# EAGLE design LB_BIT_o21_number-v03(rev3_3) (EAGLE 6.6.0)
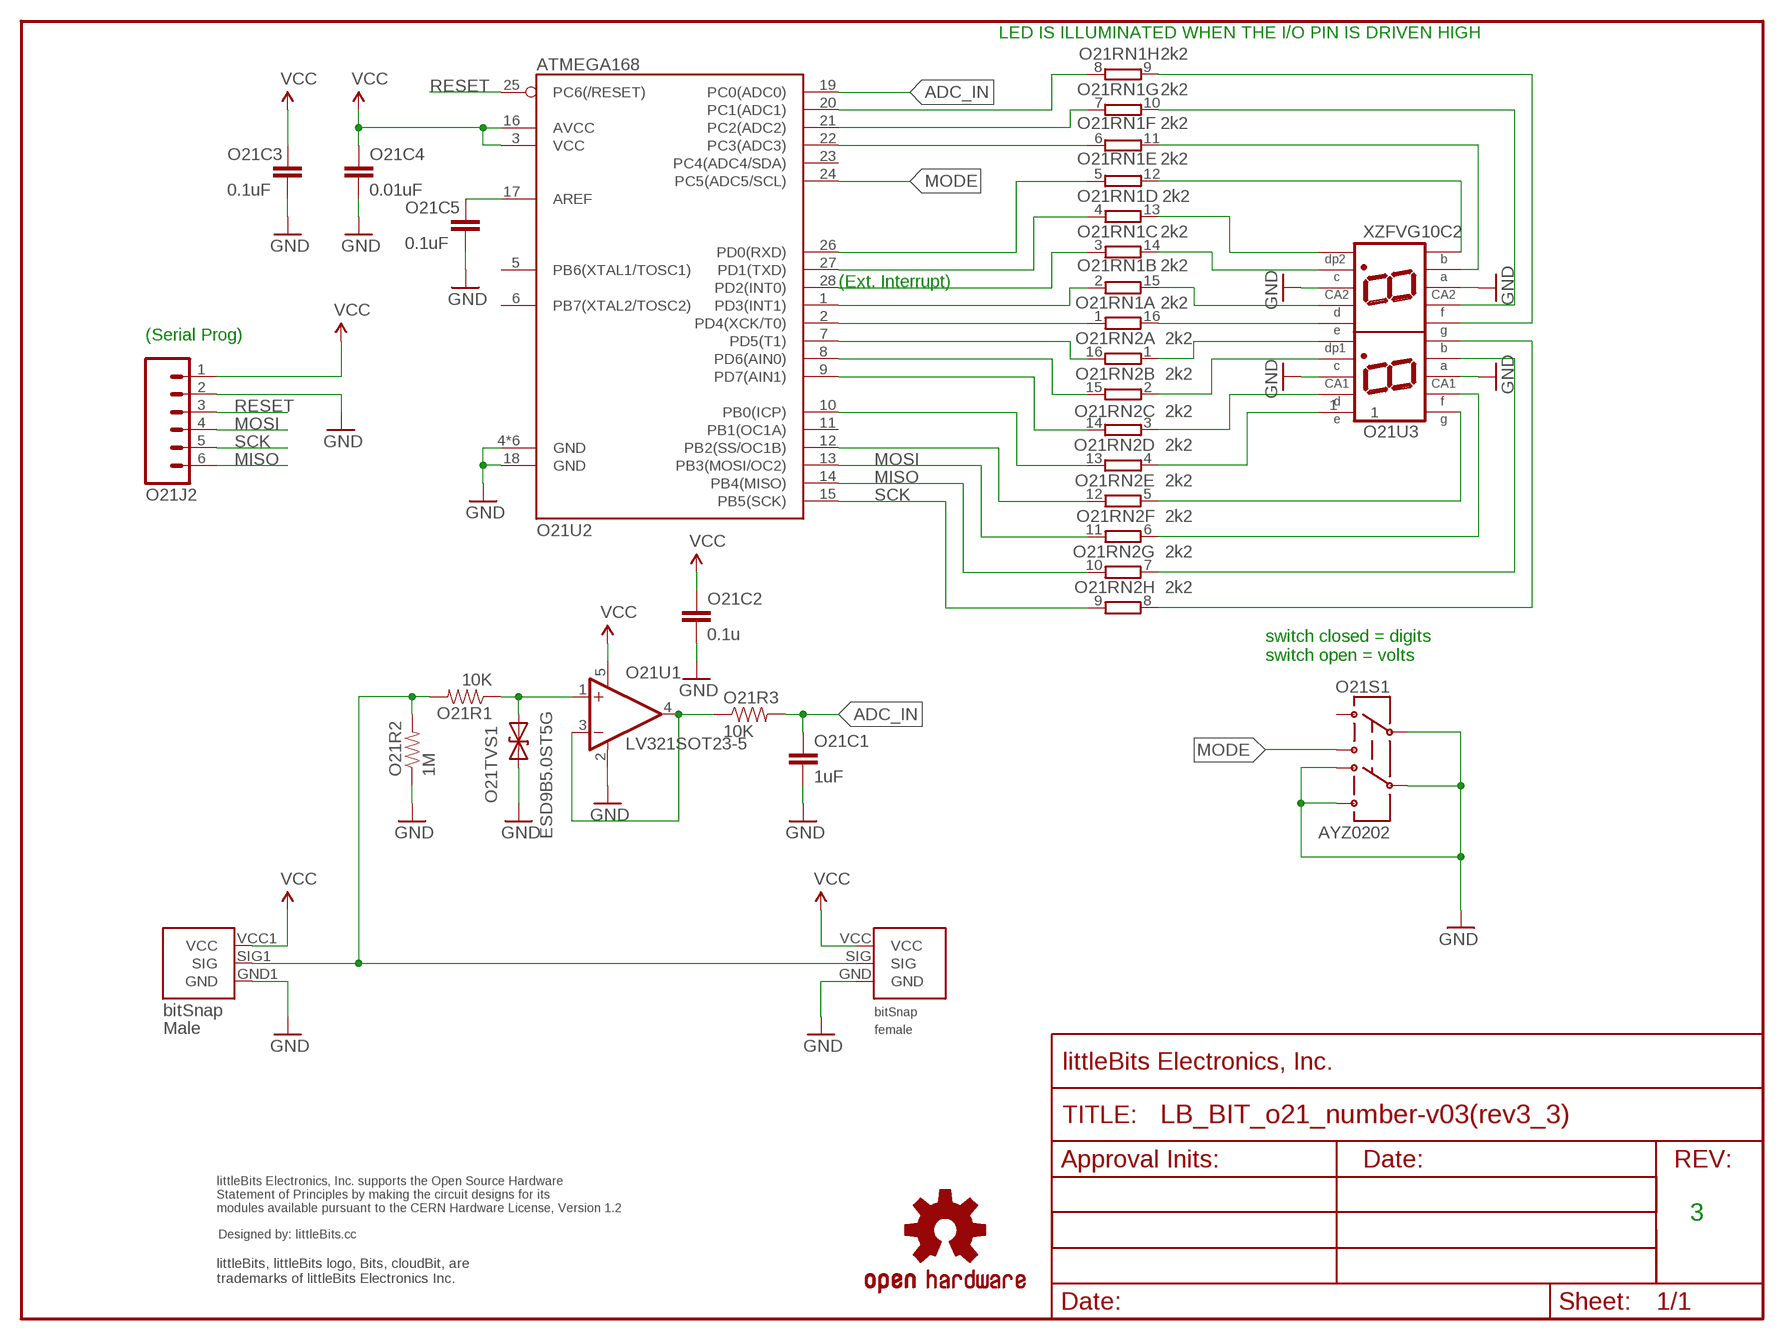
[diagram p0: schematic, sheet 1]

## Parts
O21BSF1  BITSNAP_V03_FEMALE  [BITSNAP_V03_FEMALE]
O21BSM1  BITSNAP_V03_MALE  [BITSNAP_V03_MALE]
O21C1  1uF  CAPCAP-0603  [CAP-0603]
O21C2  0.1u  CAPCAP-0603  [CAP-0603]
O21C3  0.1uF  CAPCAP-0603  [CAP-0603]
O21C4  0.01uF  CAPCAP-0603  [CAP-0603]
O21C5  0.1uF  CAPCAP-0603  [CAP-0603]
O21J2  HRD-60.1INCH_NO_SILKSCREEN  [SIP6-SM-0.1IN-NOS.S.]
O21R1  10K  RESISTOR0603  [RES-0603]
O21R2  1M  RESISTOR0603  [RES-0603]
O21R3  10K  RESISTOR0603  [RES-0603]
O21RN1  2k2  RES_ARRAY8_DIPEXB2HV  [EXB2HV]
O21RN2  2k2  RES_ARRAY8_DIPEXB2HV  [EXB2HV]
O21S1  AYZ0202  [AYZ0202]
O21TVS1  ESD9B5.0ST5G  DIODE-TVSSOD-923  [SOD-923]
O21U1  LV321SOT23-5  [SOT23-5]
O21U2  ATMEGA168  ATMEGA168-28PINVFQFN-28  [VQFN28]
O21U3  XZFVG10C2  LED-DUAL7SEG10.16MMDIGITS  [LED-DUAL7SEG-SM]
U$7  OSHWCREDIT  [OSHWCREDIT]
U$16  FRAME-LETTER-OHWOHW  [FABDWG01-OHW]
U$27  OSHW-LOGOL  [OSHW-LOGO-L]

## Nets
ADC_IN: O21C1.1 O21R3.2 O21U2.19(PC0(ADC0))
BIT_SIG: O21R3.1 O21U1.3(-IN) O21U1.4(OUT)
GND: O21BSF1.GND O21BSM1.GND1(GND) O21C1.2 O21C2.2 O21C3.2 O21C4.2 O21C5.2 O21J2.2 O21R2.1 O21S1.2 O21S1.4 O21S1.5 O21S1.6 O21TVS1.1(A) O21U1.2(V-) O21U2.4(GND) O21U2.18(GND) O21U2.TH(GND) O21U2.TH@1(GND) O21U2.TH@2(GND) O21U2.TH@3(GND) O21U2.TH@4(GND) O21U3.3 O21U3.8 O21U3.13 O21U3.18
MISO: O21J2.6 O21RN2.10 O21U2.14(PB4(MISO))
MODE: O21S1.3 O21U2.24(PC5(ADC5/SCL))
MOSI: O21J2.4 O21RN2.11 O21U2.13(PB3(MOSI/OC2))
N$1: O21RN1.7 O21U2.21(PC2(ADC2))
N$2: O21RN1.8 O21U2.20(PC1(ADC1))
N$3: O21RN1.6 O21U2.22(PC3(ADC3))
N$4: O21RN1.1 O21U2.2(PD4(XCK/T0))
N$5: O21RN1.2 O21U2.1(PD3(INT1))
N$6: O21RN1.3 O21U2.28(PD2(INT0))
N$7: O21RN1.4 O21U2.27(PD1(TXD))
N$8: O21RN1.5 O21U2.26(PD0(RXD))
N$9: O21RN2.16 O21U2.7(PD5(T1))
N$10: O21RN2.15 O21U2.8(PD6(AIN0))
N$11: O21RN2.14 O21U2.9(PD7(AIN1))
N$12: O21RN2.13 O21U2.10(PB0(ICP))
N$13: O21RN2.12 O21U2.12(PB2(SS/OC1B))
N$16: O21RN1.16 O21U3.6
N$17: O21RN1.12 O21U3.11
N$18: O21RN1.11 O21U3.12
N$19: O21RN1.10 O21U3.14
N$20: O21RN1.9 O21U3.15
N$21: O21RN1.13 O21U3.10
N$22: O21RN1.15 O21U3.7
N$23: O21RN1.14 O21U3.9
N$25: O21RN2.1 O21U3.5
N$26: O21RN2.2 O21U3.4
N$27: O21RN2.3 O21U3.2
N$28: O21RN2.4 O21U3.1
N$29: O21RN2.5 O21U3.20
N$30: O21RN2.6 O21U3.19
N$31: O21RN2.7 O21U3.17
N$32: O21RN2.8 O21U3.16
N$33: O21C5.1 O21U2.17(AREF)
N$34: O21R1.1 O21TVS1.2(C) O21U1.1(+IN)
RESET: O21J2.3 O21U2.25(PC6(/RESET))
SCK: O21J2.5 O21RN2.9 O21U2.15(PB5(SCK))
SIG: O21BSF1.SIG O21BSM1.SIG1(SIG) O21R1.2 O21R2.2
VCC: O21BSF1.VCC O21BSM1.VCC1(VCC) O21C2.1 O21C3.1 O21C4.1 O21J2.1 O21U1.5(V+) O21U2.3(VCC) O21U2.16(AVCC)
Unconnected: O21S1.1 O21U2.5(PB6(XTAL1/TOSC1)) O21U2.6(PB7(XTAL2/TOSC2)) O21U2.11(PB1(OC1A)) O21U2.23(PC4(ADC4/SDA))

## Notes on the sheet
- LED IS ILLUMINATED WHEN THE I/O PIN IS DRIVEN HIGH
- (Ext. Interrupt)
- (Serial Prog)
- switch closed = digits
  switch open = volts
- 3

## Library data of the parts
O21BSF1 = bitSnap:BITSNAP_V03_FEMALE
O21BSM1 = bitSnap:BITSNAP_V03_MALE
O21C1-O21C5 = LITTLEBITS:CAP
O21J2 = LITTLEBITS:HRD-6
O21R1-O21R3 = LITTLEBITS:RESISTOR
O21RN1 O21RN2 = LITTLEBITS:RES_ARRAY8_DIP: DIL RESISTOR
O21S1 = LITTLEBITS:AYZ0202
O21TVS1 = LITTLEBITS:DIODE-TVS: Bidirectional Transient Voltage Suppression Diode: Device conducts in avalanche mode after reaching a part dependent voltage threshold. Used for limiting voltage spikes on ESD sensitive inputs and outputs.; IEC_ESD_PROT0: +/-18kV; LB_PN: ?; MPN: ESD9B5.0ST5G; V_CLAMP: ?; V_OPERATION: 5V
O21U1 = LITTLEBITS:LV321
O21U2 = LITTLEBITS:ATMEGA168-28PIN
O21U3 = LITTLEBITS:LED-DUAL7SEG
U$7 = LITTLEBITS:OSHWCREDIT
U$16 = LITTLEBITS:FRAME-LETTER-OHW
U$27 = LITTLEBITS:OSHW-LOGO: Open Source Hardware Logo This logo indicates the piece of hardware it is found on incorporates a OSHW license and/or adheres to the definition of open source hardware found here: http://freedomdefined.org/OSHW

## Board
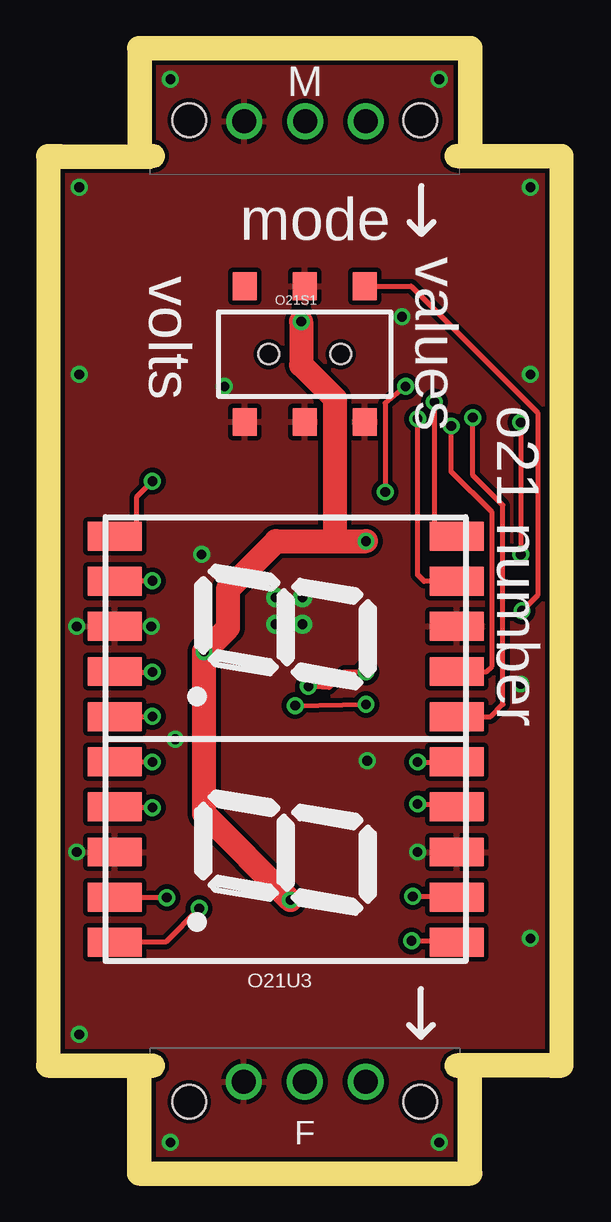
[diagram p1: board, top side]
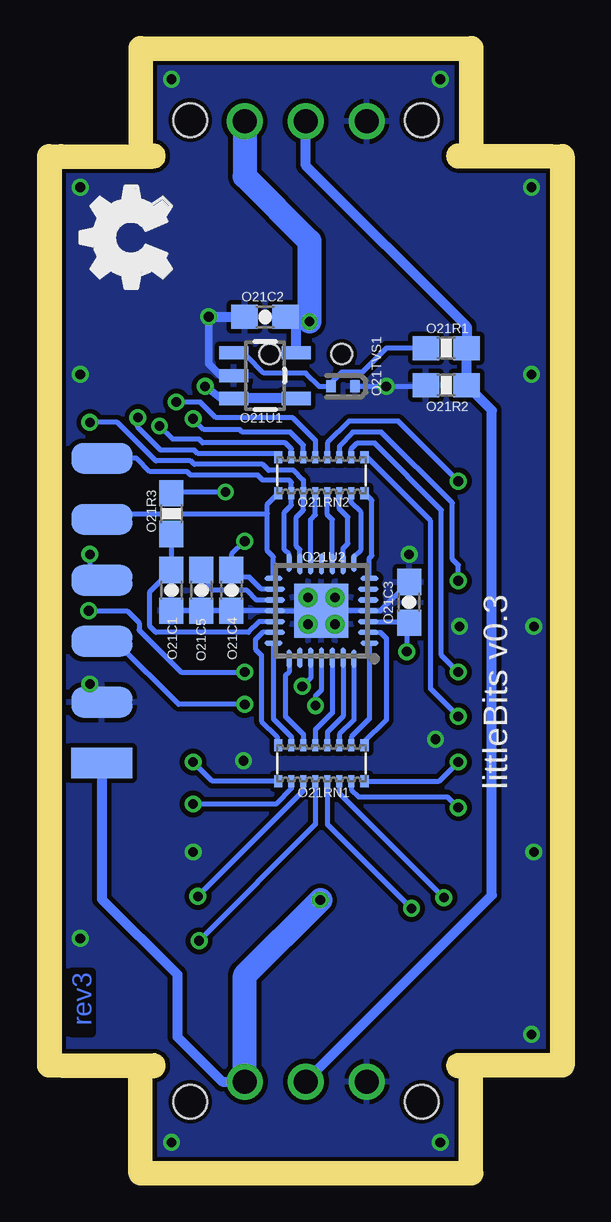
[diagram p2: board, bottom side, seen from below]

Size 20.4 x 45.9 mm. Coordinates in mm from the lower left corner, seen from the top.
Outline: 0,4.5 0,41.4
Outline: 20.4,41.4 20.4,4.5
Copper layers (1*16): Top 0.035mm / dielectric 1.5mm / Bottom 0.035mm
Design rules "littleBitsDRC": minimum track width 0.2mm, minimum drill 0.4mm, track to track 0.2mm, track to pad 0.2mm, pad to pad 0.2mm, via to via 0.2mm, smd to smd 0mil, copper to edge 0.2mm, drill to drill 0.2mm, minimum pad ring 0.2mm, minimum via ring 0.15mm, stop-mask expansion 0.1mm, vias tented up to drill 0mil, thermal gap 0.2mm
Milling: 6 lines

### Footprints (pad centres in the part's own frame; a part is rotated, then mirrored left to right if it is on the bottom)
BITSNAP_V03_FEMALE = drill 1: GND 3.91,3.33; SIG 6.45,3.33; VCC 8.99,3.33 | hole 1.4: 1.63,2.5; 11.27,2.5
BITSNAP_V03_MALE = drill 1: GND1 8.98,2.56; SIG1 6.44,2.56; VCC1 3.9,2.56 | hole 1.4: 11.27,2.5; 1.63,2.5
CAP-0603 = smd 1.1 x 1: 1 -0.85,0; 2 0.85,0
SIP6-SM-0.1IN-NOS.S. = smd 1.27 x 2.54: 1 -6.35,0; 2 -3.81,0; 3 -1.27,0; 4 1.27,0; 5 3.81,0; 6 6.35,0
RES-0603 = smd 1.1 x 1: 1 -0.85,0; 2 0.85,0
EXB2HV = smd 0.35 x 0.5: 1 -1.8,-0.75; 8 1.8,-0.75; 9 1.8,0.75; 16 -1.8,0.75 | smd 0.25 x 0.5: 2 -1.25,-0.75; 3 -0.75,-0.75; 4 -0.25,-0.75; 5 0.25,-0.75; 6 0.75,-0.75; 7 1.25,-0.75; 10 1.25,0.75; 11 0.75,0.75; 12 0.25,0.75; 13 -0.25,0.75; 14 -0.75,0.75; 15 -1.25,0.75
AYZ0202 = smd 1 x 1.15: 1 -2.5,2.825; 2 0,2.825; 3 2.5,2.825; 4 -2.5,-2.825; 5 0,-2.825; 6 2.5,-2.825 | hole 0.85: 1.5,0; -1.5,0
SOD-923 = smd 0.4 x 0.5: 1 -0.5,0; 2 0.5,0
SOT23-5 = smd 0.55 x 1.2: 1 -0.95,-1.3; 2 0,-1.3; 3 0.95,-1.3; 4 0.95,1.3; 5 -0.95,1.3
VQFN28 = smd 0.75 x 0.2: 1 -2,1.35; 7 -2,-1.35; 15 2,-1.35; 21 2,1.35 | smd 0.85 x 0.2: 2 -1.95,0.9; 3 -1.95,0.455; 4 -1.95,0; 5 -1.95,-0.45; 6 -1.95,-0.9; 16 1.95,-0.9; 17 1.95,-0.45; 18 1.95,0; 19 1.95,0.45; 20 1.95,0.9 | smd 0.2 x 0.75: 8 -1.35,-2; 14 1.35,-2; 22 1.35,2; 28 -1.35,2 | smd 0.2 x 0.85: 9 -0.9,-1.95; 10 -0.45,-1.95; 11 0,-1.95; 12 0.45,-1.95; 13 0.9,-1.95; 23 0.9,1.95; 24 0.45,1.95; 25 0,1.95; 26 -0.45,1.95; 27 -0.9,1.95 | smd 2.25 x 2.25: TH 0,0 | drill 0.406 pad 0.406: TH@1 -0.559,0.559; TH@2 0.559,0.559; TH@3 -0.559,-0.559; TH@4 0.559,-0.559
LED-DUAL7SEG-SM = smd 1.2 x 2.25: 1 -8.46,-7.125; 2 -6.58,-7.125; 3 -4.7,-7.125; 4 -2.82,-7.125; 5 -0.94,-7.125; 6 0.94,-7.125; 7 2.82,-7.125; 8 4.7,-7.125; 9 6.58,-7.125; 10 8.46,-7.125; 11 8.46,7.125; 12 6.58,7.125; 13 4.7,7.125; 14 2.82,7.125; 15 0.94,7.125; 16 -0.94,7.125; 17 -2.82,7.125; 18 -4.7,7.125; 19 -6.58,7.125; 20 -8.46,7.125

### Placement (x,y rotation side)
O21BSF1  3.75,0 0 top
O21BSM1  16.65,45.9 180 top
O21C1  15.8,23.8 270 bottom
O21C2  11.9,35.2 180 bottom
O21C3  5.9,23.3 90 bottom
O21C4  13.3,23.8 270 bottom
O21C5  14.55,23.8 270 bottom
O21J2  18.7,22.95 90 bottom
O21R1  4.35,33.9 0 bottom
O21R2  4.35,32.35 0 bottom
O21R3  15.8,27 270 bottom
O21RN1  9.55,16.6 180 bottom
O21RN2  9.55,28.6 180 bottom
O21S1  10.2,33.65 0 top
O21TVS1  8.65,32.3 180 bottom
O21U1  11.9,32.75 270 bottom
O21U2  9.55,22.95 180 bottom
O21U3  9.4,17.6 270 top
U$7  -92.7,-63.3 0 top  (outside the outline)
U$16  0,0 0 top
U$20  [OSHW_FILLX150_NOTEXT]  15.8,35.55 0 top
U$27  -24.65,-71.5 0 top  (outside the outline)

### Tracks (layer width: path | path; a pad name or v marks a point on that pad's centre or on a via)
ADC_IN
  Bottom 0.203: O21R3.2 O21C1.1 16.7,23.75 16.7,22.3 16.45,22.05 12.6,22.05 12.15,22.5 O21U2.19
BIT_SIG  (via drill 0.41)
  Top 0.203: v14.4,32.3 13.55,31.6 v13.55,27.9
  Bottom 0.203: 16.2,27.85 O21R3.1 15.8,27.75 15.75,27.9 v13.55,27.9
  Bottom 0.305: O21U1.3 13.75,31.8 v14.4,32.3
  Bottom 0.406: O21U1.4 O21U1.3
GND  (via drill 0.41)
  Bottom 0.2: v19.2,19.9 18.95,19.85 | v6.85,32.3 5.35,32.3 5.25,32.4 O21R2.1
  Bottom 0.203: O21U2.TH 10.05,23.45 | O21U2.TH 9.05,23.45 9.05,22.45 10.05,22.45 O21U2.TH@2 | O21U2.TH O21U2.4 7.1,22.95 O21C3.2 | O21U2.TH O21U2.18 O21C4.2 O21C5.2 O21C1.2 15.9,22.95 | O21J2.2 19.1,19.09 v19.2,19.9 | O21TVS1.1 v6.85,32.3
  Bottom 0.305: O21U1.2 13.75,32.75 14.25,33.25 v14.25,35.2
  Bottom 0.406: v14.25,35.2 O21C2.2
  other vias: 4.6,45.1 15.8,45.1 0.8,40.6 19.6,40.6 19.6,32.8 0.8,32.8 5.9,25.3 0.7,22.3 0.7,12.9 12.8,16.7 19.6,9.3 0.8,5.3 4.6,0.8 15.8,0.8 14.9,12.9 3.8,22.3 4.8,17.6
  pour Top: 0,0 20.4,0 20.4,45.9 0,45.9
  pour Top (no thermals): 8,23.4 8,21.6 10.4,21.6 11,22.2 11,24.2 10.8,24.4 9,24.4
  pour Bottom: 0,0 20.4,0 20.4,45.9 0,45.9
MISO
  Bottom 0.2: 10.8,28.3 10.9,28.4 12,28.4 12.2,28.6 15,28.6 15.15,28.75
  Bottom 0.203: O21U2.14 10.9,25.3 11.1,25.5 11.1,27.05 10.8,27.35 O21RN2.10 10.8,28.3 | 15.15,28.75 16.7,28.75 17.25,29.3 O21J2.6
MODE  (via drill 0.41)
  Top 0.203: O21S1.3 14.62,36.48 19.9,31.2 19.9,23.6 v19.25,22.95 | v12.75,20.4 11.85,20.4 11.2,19.75 v10.35,19.8
  Bottom 0.2: O21U2.24 10,20.15 v10.35,19.8
  Bottom 0.203: v19.25,22.95 17.65,22.95 17.15,22.45 17.15,22.15 15.4,20.4 v12.75,20.4
MOSI  (via drill 0.41)
  Top 0.203: v19.2,30.8 v19.2,25.3
  Bottom 0.2: 10.3,28.4 10.7,28.8 11.75,28.8 12,29.05 14.85,29.05 15,29.2
  Bottom 0.203: O21U2.13 10.45,25.5 10.6,25.65 10.6,26.85 10.3,27.15 O21RN2.11 10.3,28.4 | 15,29.2 16.45,29.2 18.05,30.8 v19.2,30.8 | v19.2,25.3 19.2,24.45 18.95,24.2 O21J2.4
N$1
  Bottom 0.203: O21U2.21 11.55,18.45 10.8,17.7 O21RN1.7
N$2
  Bottom 0.203: O21U2.20 12,22.05 12.3,21.75 12.3,21.35 12.05,21.1 12.05,18.35 11.4,17.7 11.4,17.4 O21RN1.8
N$3
  Bottom 0.203: O21U2.22 10.9,20.4 11.05,20.25 11.05,18.55 10.3,17.8 O21RN1.6
N$4
  Bottom 0.203: O21U2.2 7.1,22.05 6.85,21.8 6.85,18.4 7.8,17.45 O21RN1.1
N$5
  Bottom 0.203: O21U2.1 7.55,18.45 8.3,17.7 O21RN1.2
N$6
  Bottom 0.203: O21U2.28 8.2,18.4 8.8,17.8 O21RN1.3
N$7
  Bottom 0.203: O21U2.27 8.65,18.55 9.3,17.9 O21RN1.4
N$8
  Bottom 0.203: O21U2.26 9.1,18.7 9.8,18 O21RN1.5
N$9
  Bottom 0.203: O21U2.7 7.55,25.15 7.45,25.25 7.45,27.55 O21RN2.16
N$10
  Bottom 0.203: O21U2.8 8.2,25.2 7.9,25.5 7.9,27.05 8.3,27.45 O21RN2.15
N$11
  Bottom 0.203: O21U2.9 8.65,25.55 8.45,25.75 8.45,26.85 8.8,27.2 O21RN2.14
N$12
  Bottom 0.203: O21U2.10 9.1,26.75 9.3,26.95 O21RN2.13
N$13
  Bottom 0.203: O21U2.12 10,26.75 9.8,26.95 O21RN2.12
N$16  (via drill 0.41)
  Top 0.203: v3.85,16.65 O21U3.6
  Bottom 0.203: O21RN1.16 7.8,15.75 7.75,15.7 O21RN1.16 | O21RN1.16 4.65,15.85 v3.85,16.65
N$17  (via drill 0.41)
  Top 0.203: v14.65,9.2 16.46,9.2 O21U3.11
  Bottom 0.203: O21RN1.12 9.8,14.05 v14.65,9.2
N$18  (via drill 0.41)
  Top 0.203: v14.7,11.05 16.5,11.05 O21U3.12
  Bottom 0.203: O21RN1.11 10.3,15.45 v14.7,11.05
N$19  (via drill 0.41)
  Top 0.203: v14.9,14.9 16.41,14.9 O21U3.14
  Bottom 0.203: 10.8,15.9 O21RN1.10 10.8,15.55 11.45,14.9 v14.9,14.9
N$20  (via drill 0.41)
  Top 0.203: v14.9,16.65 O21U3.15
  Bottom 0.203: O21RN1.9 14.1,15.85 v14.9,16.65
N$21  (via drill 0.41)
  Top 0.203: v5.8,10.55 4.4,9.15 O21U3.10
  Bottom 0.203: O21RN1.13 9.3,14.05 v5.8,10.55
N$22  (via drill 0.41)
  Top 0.203: v3.85,14.75 2.31,14.75 O21U3.7
  Bottom 0.203: O21RN1.15 8.3,15.5 8,15.2 4.3,15.2 v3.85,14.75
N$23  (via drill 0.41)
  Top 0.203: v4.45,11 2.29,11 O21U3.9
  Bottom 0.203: O21RN1.14 8.8,15.35 v4.45,11
N$25  (via drill 0.41)
  Top 0.2: O21U3.5 3.8,18.54 v3.85,18.55
  Bottom 0.2: v3.85,18.55 5,19.7 5,26.7 7.75,29.45
  Bottom 0.203: O21RN2.1 7.75,29.45
N$26  (via drill 0.41)
  Top 0.2: O21U3.4 3.13,20.4 v3.85,20.4
  Bottom 0.2: v3.85,20.4 4.55,21.1 4.55,27.15 7.35,29.95
  Bottom 0.203: O21RN2.2 8.3,29.7 8.05,29.95 7.35,29.95
N$27  (via drill 0.41)
  Top 0.2: O21U3.2 3.19,24.2 v3.85,24.2
  Bottom 0.2: v3.85,24.2 3.85,24.85 4.1,25.1 4.1,27.45 7.05,30.4
  Bottom 0.203: 7.05,30.4 8.25,30.4 8.8,29.8 O21RN2.3
N$28  (via drill 0.41)
  Top 0.2: O21U3.1 3.25,26.06 3.2,26.3 3.2,27.7 v3.85,28.35
  Bottom 0.203: v3.85,28.35 6.35,30.85 8.4,30.85 9.3,29.95 O21RN2.4
N$29  (via drill 0.41)
  Top 0.2: v15.6,31.65 15.6,26.06 O21U3.20
  Top 0.203: O21U3.20 16.71,26.06 16.88,26.25
  Bottom 0.2: O21RN2.5 9.8,30.05 10.75,31 13.95,31 14.6,31.65 v15.6,31.65
N$30  (via drill 0.41)
  Top 0.203: O21U3.19 15.17,24.18 14.9,24.45 v14.9,30.95
  Bottom 0.203: O21RN2.6 10.3,29.85 10.85,30.4 12.85,30.4 12.95,30.5 14.45,30.5 v14.9,30.95
N$31  (via drill 0.41)
  Top 0.203: O21U3.17 17.77,20.42 18,20.65 18,27.05 16.3,28.75 v16.3,30.65
  Bottom 0.2: O21RN2.7 10.8,29.7 11.05,29.95 14.5,29.95 14.65,30.1 15.75,30.1 v16.3,30.65
N$32  (via drill 0.41)
  Top 0.203: O21U3.16 17.94,18.54 18.45,19.05 18.45,27.35 17.2,28.6 v17.2,31
  Bottom 0.203: O21RN2.8 11.35,29.5 14.7,29.5 14.85,29.65 16.25,29.65 17.2,30.6 v17.2,31
N$33
  Bottom 0.2: 12.25,23.4 12.65,23.8 14.1,23.8 14.25,23.95 14.25,24.35
  Bottom 0.203: O21U2.17 12.25,23.4 | 14.25,24.35 O21C5.1
N$34
  Bottom 0.203: 12.9,33.7 O21U1.1 12.9,33.55 12.65,33.55 11.95,32.85 10.2,32.85 9.65,32.3 O21TVS1.2 9.2,32.4 8.7,32.9 7.85,32.9 6.85,33.9 O21R1.1
RESET  (via drill 0.41)
  Top 0.203: v9.8,19 v12.75,19.05
  Bottom 0.203: O21U2.25 9.55,19.65 9.8,19.4 v9.8,19 | v12.75,19.05 15.5,19.05 18.05,21.6 17.98,21.58 O21J2.3
SCK
  Bottom 0.2: 18.6,27 11.8,27
  Bottom 0.203: O21U2.15 11.55,25.2 11.8,25.45 11.8,27 11.8,27.4 O21RN2.9 | O21J2.5 18.61,27.01 18.6,27
SIG
  Bottom 0.2: O21BSF1.SIG 10.2,3.35
  Bottom 0.406: 10.2,3.35 2.45,11.1 2.45,31.3 O21R2.2 O21R1.2 3.5,34.8 10.2,41.5 10.2,43.05 O21BSM1.SIG1
VCC  (via drill 0.41)
  Top 1: v10.05,35 10.05,33.2 11.45,31.8 11.45,25.85 | 11.45,25.85 9,25.85 7,23.85 7,22.25 v6,21.25 6,14.5 v9.6,10.9 | 11.45,25.85 v12.75,25.85
  Bottom 0.2: O21C3.1 arc90 6.16,22.5 O21U2.3 6,22.5 v6,21.25 | O21U1.5 10.65,33.75 | v12.75,25.85 13.3,25.3 O21C4.1 13,24.35 12.55,24.35 12.05,23.85 O21U2.16
  Bottom 0.406: v10.05,35 10.95,35.1 O21C2.1 10.6,35.1 O21U1.5 | O21J2.1 18.7,10.94 15.55,7.8 15.55,5.2 13.68,3.33 O21BSF1.VCC
  Bottom 1: O21BSF1.VCC 12.74,7.76 v9.6,10.9 | O21BSM1.VCC1 12.75,41.05 10.05,38.35 v10.05,35

### Text on the board
Bottom: rev3
tPlace: mode | values | volts | o21 number
bPlace: littleBits v0.3
tNames: O21U3
tValues: XZFVG10C2
Milling: 1MM ROUTER PATH
Reference: XLARGE
dxf: 3 | OUTPUT BIT THAT DISPLAYS VOLTAGE ON SIGNAL LINE